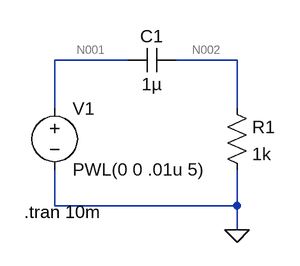
[diagram p0: schematic B_DC.asc]
B_DC.asc, the LTspice schematic file:
Version 4
SHEET 1 880 680
WIRE 160 144 64 144
WIRE 304 144 224 144
WIRE 64 208 64 144
WIRE 304 208 304 144
WIRE 64 336 64 288
WIRE 304 336 304 288
WIRE 304 336 64 336
WIRE 304 368 304 336
FLAG 304 368 0
SYMBOL cap 224 128 R90
WINDOW 0 0 32 VBottom 2
WINDOW 3 32 32 VTop 2
SYMATTR InstName C1
SYMATTR Value 1µ
SYMBOL res 288 192 R0
SYMATTR InstName R1
SYMATTR Value 1k
SYMBOL voltage 64 192 R0
WINDOW 123 0 0 Left 0
WINDOW 39 0 0 Left 0
SYMATTR InstName V1
SYMATTR Value PWL(0 0 .01u 5)
TEXT 24 344 Left 2 !.tran 10m

The netlist it stands for:
* B_DC.asc
C1 N002 N001 1µ
R1 N002 0 1k
V1 N001 0 PWL(0 0 .01u 5)
.tran 10m
.backanno
.end

* Results of the author's LTspice run, read from the files saved beside the schematic
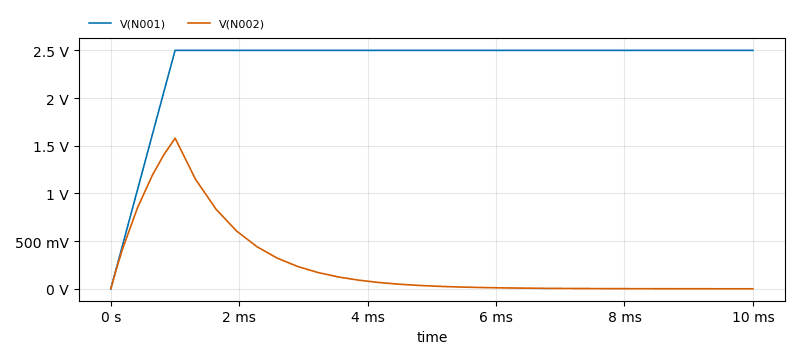
[diagram p1: Transient Analysis of B_DC.asc, plotted from the saved traces]
* Transient Analysis, 1 run:
*   V(N001): min 0 V, max 2.5 V, average 2.375 V, rms 2.416 V, last 2.5 V
*   V(N002): min 0 V, max 1.579 V, average 250.8 mV, rms 484.5 mV, last 195 µV